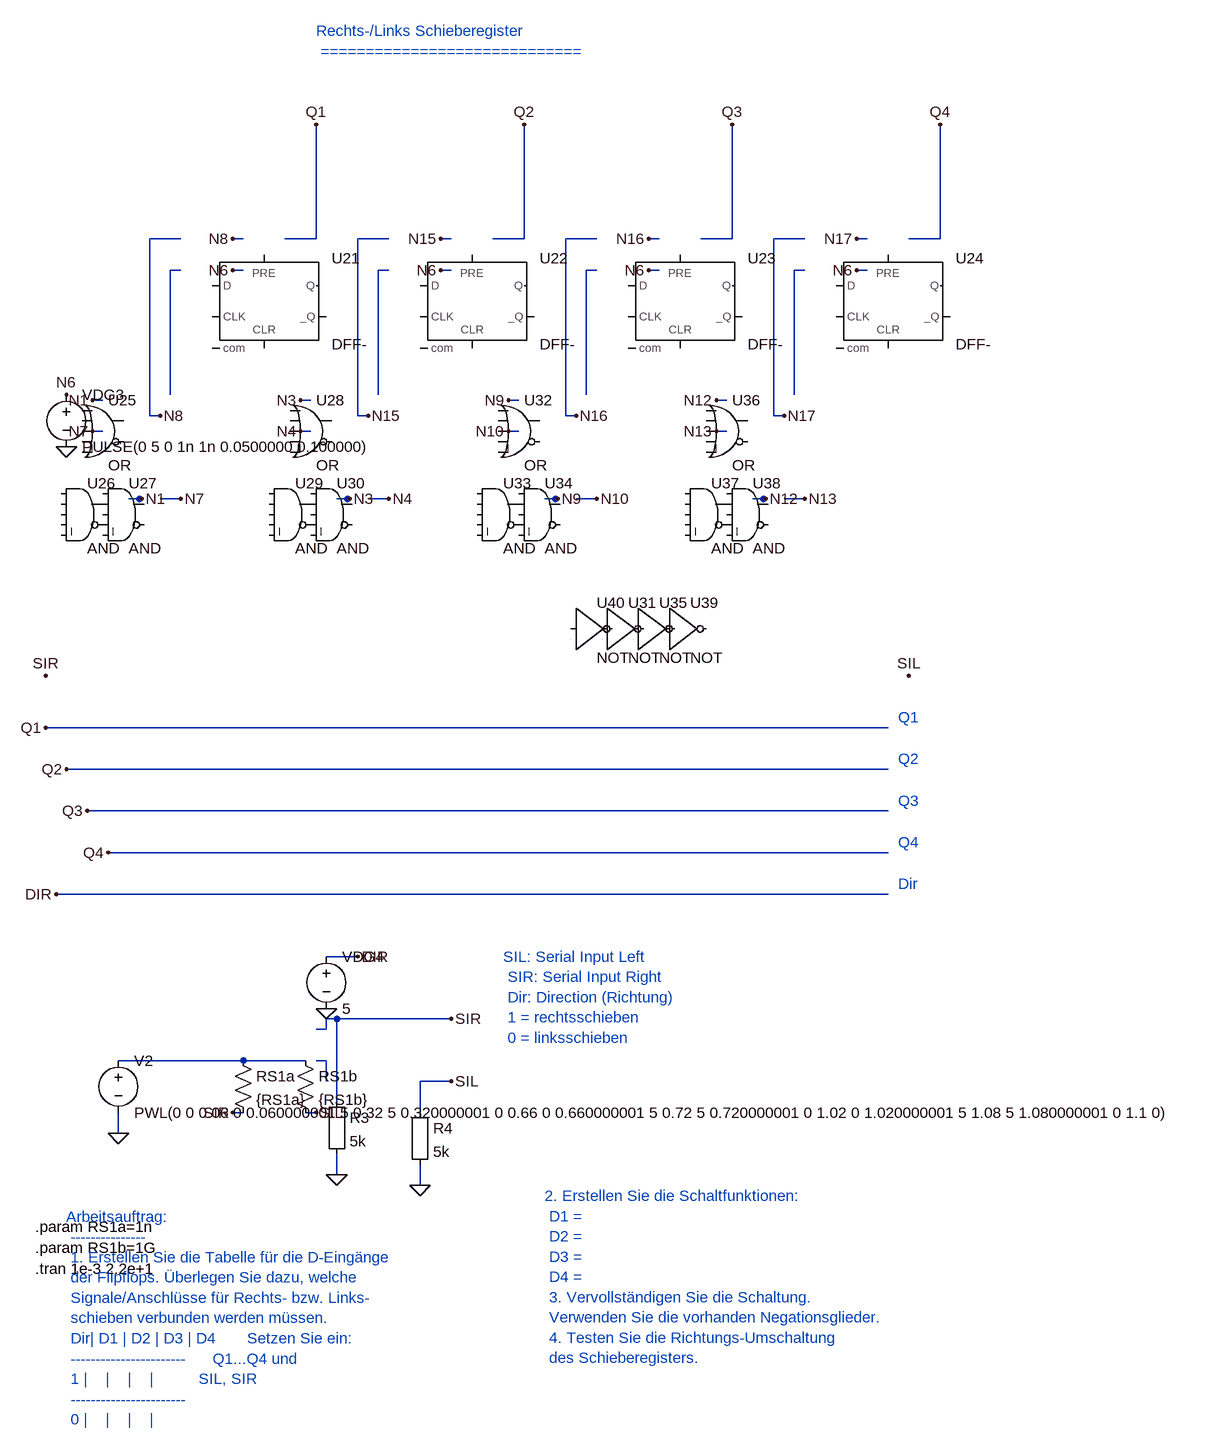
[diagram p0: schematic 6_3_2_Rechts_Links_Schieberegister.asc]
6_3_2_Rechts_Links_Schieberegister.asc, the LTspice schematic file:
Version 4
SHEET 1 880 680
WIRE 192 1696 192 1712
WIRE 384 1616 480 1616
WIRE 448 352 496 352
WIRE 496 352 496 176
WIRE 1088 352 1136 352
WIRE 1136 352 1136 176
WIRE 768 352 816 352
WIRE 816 352 816 176
WIRE 1456 176 1456 352
WIRE 1456 352 1408 352
WIRE 272 592 272 400
WIRE 272 400 288 400
WIRE 608 400 592 400
WIRE 592 400 592 592
WIRE 1248 400 1232 400
WIRE 1232 400 1232 592
WIRE 928 400 912 400
WIRE 912 400 912 592
WIRE 192 1728 192 1712
WIRE 208 752 224 752
WIRE 256 752 272 752
WIRE 240 624 240 352
WIRE 240 352 288 352
WIRE 528 752 544 752
WIRE 576 752 592 752
WIRE 848 752 864 752
WIRE 896 752 912 752
WIRE 1168 752 1184 752
WIRE 1216 752 1232 752
WIRE 560 624 560 352
WIRE 560 352 608 352
WIRE 880 624 880 352
WIRE 880 352 928 352
WIRE 1200 624 1200 352
WIRE 1200 352 1248 352
WIRE 176 1296 1376 1296
WIRE 1376 1232 144 1232
WIRE 1376 1360 96 1360
WIRE 512 1456 560 1456
WIRE 384 1616 192 1616
WIRE 704 1552 528 1552
WIRE 704 1648 656 1648
WIRE 1376 1168 112 1168
WIRE 528 1792 528 1760
WIRE 528 1552 512 1552
WIRE 512 1552 512 1568
WIRE 512 1568 496 1568
WIRE 528 1680 528 1552
WIRE 656 1808 656 1776
WIRE 512 1648 512 1616
WIRE 512 1616 496 1616
WIRE 656 1696 656 1648
WIRE 80 1104 1376 1104
WIRE 1344 400 1328 400
WIRE 704 400 688 400
WIRE 384 400 368 400
WIRE 1024 400 1008 400
WIRE 208 752 228 752
WIRE 168 600 152 600
WIRE 168 648 152 648
WIRE 272 752 288 752
WIRE 240 624 256 624
WIRE 384 352 368 352
WIRE 480 1696 496 1696
WIRE 384 1696 368 1696
WIRE 528 752 548 752
WIRE 488 600 472 600
WIRE 488 648 472 648
WIRE 592 752 608 752
WIRE 848 752 868 752
WIRE 808 600 792 600
WIRE 808 648 792 648
WIRE 912 752 928 752
WIRE 1168 752 1188 752
WIRE 1128 600 1112 600
WIRE 1128 648 1112 648
WIRE 1232 752 1248 752
WIRE 560 624 576 624
WIRE 704 352 688 352
WIRE 880 624 896 624
WIRE 1024 352 1008 352
WIRE 1200 624 1216 624
WIRE 1344 352 1328 352
FLAG 112 672 0
FLAG 512 1536 0
FLAG 192 1728 0
FLAG 528 1792 0
FLAG 656 1808 0
FLAG 1328 400 N6
FLAG 688 400 N6
FLAG 368 400 N6
FLAG 112 592 N6
FLAG 1008 400 N6
FLAG 192 1728 0
FLAG 528 1792 0
FLAG 656 1808 0
FLAG 228 752 N1
FLAG 152 600 N1
FLAG 152 648 N7
FLAG 288 752 N7
FLAG 256 624 N8
FLAG 368 352 N8
FLAG 80 1104 Q1
FLAG 496 176 Q1
FLAG 112 1168 Q2
FLAG 816 176 Q2
FLAG 144 1232 Q3
FLAG 1136 176 Q3
FLAG 176 1296 Q4
FLAG 1456 176 Q4
FLAG 704 1648 SIL
FLAG 1408 1024 SIL
FLAG 496 1696 SIL
FLAG 704 1552 SIR
FLAG 80 1024 SIR
FLAG 368 1696 SIR
FLAG 96 1360 DIR
FLAG 560 1456 DIR
FLAG 548 752 N3
FLAG 472 600 N3
FLAG 472 648 N4
FLAG 608 752 N4
FLAG 868 752 N9
FLAG 792 600 N9
FLAG 792 648 N10
FLAG 928 752 N10
FLAG 1188 752 N12
FLAG 1112 600 N12
FLAG 1112 648 N13
FLAG 1248 752 N13
FLAG 576 624 N15
FLAG 688 352 N15
FLAG 896 624 N16
FLAG 1008 352 N16
FLAG 1216 624 N17
FLAG 1328 352 N17
SYMBOL Digital\dflop 416 376 R0
SYMATTR InstName U21
SYMATTR Value DFF-
SYMATTR LibreSpice kind=dff;edge=falling;async=high;vth=2.5;vhigh=5;pins=D,CLK,SET,RESET,Q,~Q
SYMBOL Digital\dflop 736 376 R0
SYMATTR InstName U22
SYMATTR Value DFF-
SYMATTR LibreSpice kind=dff;edge=falling;async=high;vth=2.5;vhigh=5;pins=D,CLK,SET,RESET,Q,~Q
SYMBOL Digital\dflop 1056 376 R0
SYMATTR InstName U23
SYMATTR Value DFF-
SYMATTR LibreSpice kind=dff;edge=falling;async=high;vth=2.5;vhigh=5;pins=D,CLK,SET,RESET,Q,~Q
SYMBOL Digital\dflop 1376 376 R0
SYMATTR InstName U24
SYMATTR Value DFF-
SYMATTR LibreSpice kind=dff;edge=falling;async=high;vth=2.5;vhigh=5;pins=D,CLK,SET,RESET,Q,~Q
SYMBOL voltage 112 576 R0
SYMATTR InstName VDG3
SYMATTR Value PULSE(0 5 0 1n 1n 0.0500000 0.100000)
SYMBOL voltage 192 1600 R0
SYMATTR InstName V2
SYMATTR Value PWL(0 0 0.06 0 0.060000001 5 0.32 5 0.320000001 0 0.66 0 0.660000001 5 0.72 5 0.720000001 0 1.02 0 1.020000001 5 1.08 5 1.080000001 0 1.1 0)
SYMBOL Digital\or 168 584 R0
SYMATTR InstName U25
SYMATTR Value OR
SYMATTR LibreSpice gate=or;inputs=2;vth=2.5;vhigh=5;pins=In1,In2,Out
SYMBOL Digital\and 136 712 R0
SYMATTR InstName U26
SYMATTR Value AND
SYMATTR LibreSpice gate=and;inputs=2;vth=2.5;vhigh=5;pins=In1,In2,Out
SYMBOL Digital\and 200 712 R0
SYMATTR InstName U27
SYMATTR Value AND
SYMATTR LibreSpice gate=and;inputs=2;vth=2.5;vhigh=5;pins=In1,In2,Out
SYMBOL Digital\or 488 584 R0
SYMATTR InstName U28
SYMATTR Value OR
SYMATTR LibreSpice gate=or;inputs=2;vth=2.5;vhigh=5;pins=In1,In2,Out
SYMBOL Digital\and 456 712 R0
SYMATTR InstName U29
SYMATTR Value AND
SYMATTR LibreSpice gate=and;inputs=2;vth=2.5;vhigh=5;pins=In1,In2,Out
SYMBOL Digital\and 520 712 R0
SYMATTR InstName U30
SYMATTR Value AND
SYMATTR LibreSpice gate=and;inputs=2;vth=2.5;vhigh=5;pins=In1,In2,Out
SYMBOL Digital\inv 936 888 R0
SYMATTR InstName U31
SYMATTR Value NOT
SYMATTR LibreSpice gate=not;inputs=1;vth=2.5;vhigh=5;pins=In1,Out
SYMBOL Digital\or 808 584 R0
SYMATTR InstName U32
SYMATTR Value OR
SYMATTR LibreSpice gate=or;inputs=2;vth=2.5;vhigh=5;pins=In1,In2,Out
SYMBOL Digital\and 776 712 R0
SYMATTR InstName U33
SYMATTR Value AND
SYMATTR LibreSpice gate=and;inputs=2;vth=2.5;vhigh=5;pins=In1,In2,Out
SYMBOL Digital\and 840 712 R0
SYMATTR InstName U34
SYMATTR Value AND
SYMATTR LibreSpice gate=and;inputs=2;vth=2.5;vhigh=5;pins=In1,In2,Out
SYMBOL Digital\inv 984 888 R0
SYMATTR InstName U35
SYMATTR Value NOT
SYMATTR LibreSpice gate=not;inputs=1;vth=2.5;vhigh=5;pins=In1,Out
SYMBOL Digital\or 1128 584 R0
SYMATTR InstName U36
SYMATTR Value OR
SYMATTR LibreSpice gate=or;inputs=2;vth=2.5;vhigh=5;pins=In1,In2,Out
SYMBOL Digital\and 1096 712 R0
SYMATTR InstName U37
SYMATTR Value AND
SYMATTR LibreSpice gate=and;inputs=2;vth=2.5;vhigh=5;pins=In1,In2,Out
SYMBOL Digital\and 1160 712 R0
SYMATTR InstName U38
SYMATTR Value AND
SYMATTR LibreSpice gate=and;inputs=2;vth=2.5;vhigh=5;pins=In1,In2,Out
SYMBOL Digital\inv 1032 888 R0
SYMATTR InstName U39
SYMATTR Value NOT
SYMATTR LibreSpice gate=not;inputs=1;vth=2.5;vhigh=5;pins=In1,Out
SYMBOL voltage 512 1440 R0
SYMATTR InstName VDG4
SYMATTR Value 5
SYMBOL res 368 1600 R0
SYMATTR InstName RS1a
SYMATTR Value {RS1a}
SYMBOL res 464 1600 R0
SYMATTR InstName RS1b
SYMATTR Value {RS1b}
SYMBOL Misc\EuropeanResistor 512 1664 R0
SYMATTR InstName R3
SYMATTR Value 5k
SYMBOL Misc\EuropeanResistor 640 1680 R0
SYMATTR InstName R4
SYMATTR Value 5k
SYMBOL Digital\inv 888 888 R0
SYMATTR InstName U40
SYMATTR Value NOT
SYMATTR LibreSpice gate=not;inputs=1;vth=2.5;vhigh=5;pins=In1,Out
TEXT 64 1872 Left 2 !.param RS1a=1n
TEXT 64 1904 Left 2 !.param RS1b=1G
TEXT 64 1936 Left 2 !.tran 1e-3 2.2e+1
TEXT 496 32 Left 2 ;Rechts-/Links Schieberegister \n =============================
TEXT 112 1856 Left 2 ;Arbeitsauftrag: \n --------------- \n 1. Erstellen Sie die Tabelle für die D-Eingänge \n der Flipflops. Überlegen Sie dazu, welche \n Signale/Anschlüsse für Rechts- bzw. Links- \n schieben verbunden werden müssen. \n Dir| D1 | D2 | D3 | D4       Setzen Sie ein: \n -----------------------      Q1...Q4 und \n 1 |    |    |    |          SIL, SIR \n ----------------------- \n 0 |    |    |    |
TEXT 784 1456 Left 2 ;SIL: Serial Input Left \n SIR: Serial Input Right \n Dir: Direction (Richtung) \n 1 = rechtsschieben \n 0 = linksschieben
TEXT 848 1824 Left 2 ;2. Erstellen Sie die Schaltfunktionen: \n D1 = \n D2 = \n D3 = \n D4 = \n 3. Vervollständigen Sie die Schaltung. \n Verwenden Sie die vorhanden Negationsglieder. \n 4. Testen Sie die Richtungs-Umschaltung \n des Schieberegisters.
TEXT 1392 1088 Left 2 ;Q1
TEXT 1392 1152 Left 2 ;Q2
TEXT 1392 1216 Left 2 ;Q3
TEXT 1392 1280 Left 2 ;Q4
TEXT 1392 1344 Left 2 ;Dir

The netlist it stands for:
* 6_3_2_Rechts_Links_Schieberegister.asc
A§U21 0 0 0 0 0 0 0 0 DFLOP DFF-
A§U22 0 0 0 0 0 0 0 0 DFLOP DFF-
A§U23 0 0 0 0 0 0 0 0 DFLOP DFF-
A§U24 0 0 0 0 0 0 0 0 DFLOP DFF-
VDG3 N6 0 PULSE(0 5 0 1n 1n 0.0500000 0.100000)
V2 N001 0 PWL(0 0 0.06 0 0.060000001 5 0.32 5 0.320000001 0 0.66 0 0.660000001 5 0.72 5 0.720000001 0 1.02 0 1.020000001 5 1.08 5 1.080000001 0 1.1 0)
A§U25 0 0 0 0 0 0 0 0 OR OR
A§U26 0 0 0 0 0 P001 P002 0 AND AND
A§U27 0 P002 0 P001 0 0 0 0 AND AND
A§U28 0 0 0 0 0 0 0 0 OR OR
A§U29 0 0 0 0 0 P003 P004 0 AND AND
A§U30 0 P004 0 P003 0 0 0 0 AND AND
A§U31 0 0 0 0 0 0 0 0 BUF NOT
A§U32 0 0 0 0 0 0 0 0 OR OR
A§U33 0 0 0 0 0 P005 P006 0 AND AND
A§U34 0 P006 0 P005 0 0 0 0 AND AND
A§U35 0 0 0 0 0 0 0 0 BUF NOT
A§U36 0 0 0 0 0 0 0 0 OR OR
A§U37 0 0 0 0 0 P007 P008 0 AND AND
A§U38 0 P008 0 P007 0 0 0 0 AND AND
A§U39 0 0 0 0 0 0 0 0 BUF NOT
VDG4 DIR 0 5
RS1a N001 SIR {RS1a}
RS1b N001 SIL {RS1b}
R3 SIR 0 5k
R4 SIL 0 5k
A§U40 0 0 0 0 0 0 0 0 BUF NOT
.param RS1a=1n
.param RS1b=1G
.tran 1e-3 2.2e+1
* Rechts-/Links Schieberegister
*  =============================
* Arbeitsauftrag:
*  ---------------
*  1. Erstellen Sie die Tabelle für die D-Eingänge
*  der Flipflops. Überlegen Sie dazu, welche
*  Signale/Anschlüsse für Rechts- bzw. Links-
*  schieben verbunden werden müssen.
*  Dir| D1 | D2 | D3 | D4       Setzen Sie ein:
*  -----------------------      Q1...Q4 und
*  1 |    |    |    |          SIL, SIR
*  -----------------------
*  0 |    |    |    |
* SIL: Serial Input Left
*  SIR: Serial Input Right
*  Dir: Direction (Richtung)
*  1 = rechtsschieben
*  0 = linksschieben
* 2. Erstellen Sie die Schaltfunktionen:
*  D1 =
*  D2 =
*  D3 =
*  D4 =
*  3. Vervollständigen Sie die Schaltung.
*  Verwenden Sie die vorhanden Negationsglieder.
*  4. Testen Sie die Richtungs-Umschaltung
*  des Schieberegisters.
* Q1
* Q2
* Q3
* Q4
* Dir
.backanno
.end